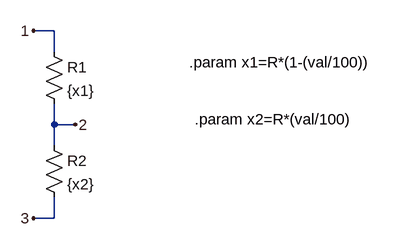
[diagram p0: schematic Potentiometer.asc]
Potentiometer.asc, the LTspice schematic file:
Version 4
SHEET 1 880 680
WIRE 176 32 144 32
WIRE 176 64 176 32
WIRE 176 176 176 144
WIRE 208 176 176 176
WIRE 176 208 176 176
WIRE 176 320 176 288
WIRE 176 320 144 320
FLAG 144 32 1
FLAG 208 176 2
FLAG 144 320 3
SYMBOL res 160 48 R0
SYMATTR InstName R1
SYMATTR Value {x1}
SYMBOL res 160 192 R0
SYMATTR InstName R2
SYMATTR Value {x2}
TEXT 384 80 Left 2 !.param x1=R*(1-(val/100))
TEXT 392 168 Left 2 !.param x2=R*(val/100)

The netlist it stands for:
* Potentiometer.asc
R1 1 2 {x1}
R2 2 3 {x2}
.param x1=R*(1-(val/100))
.param x2=R*(val/100)
.backanno
.end